# EAGLE design Mimi_layout_logo (EAGLE 7.6.0)
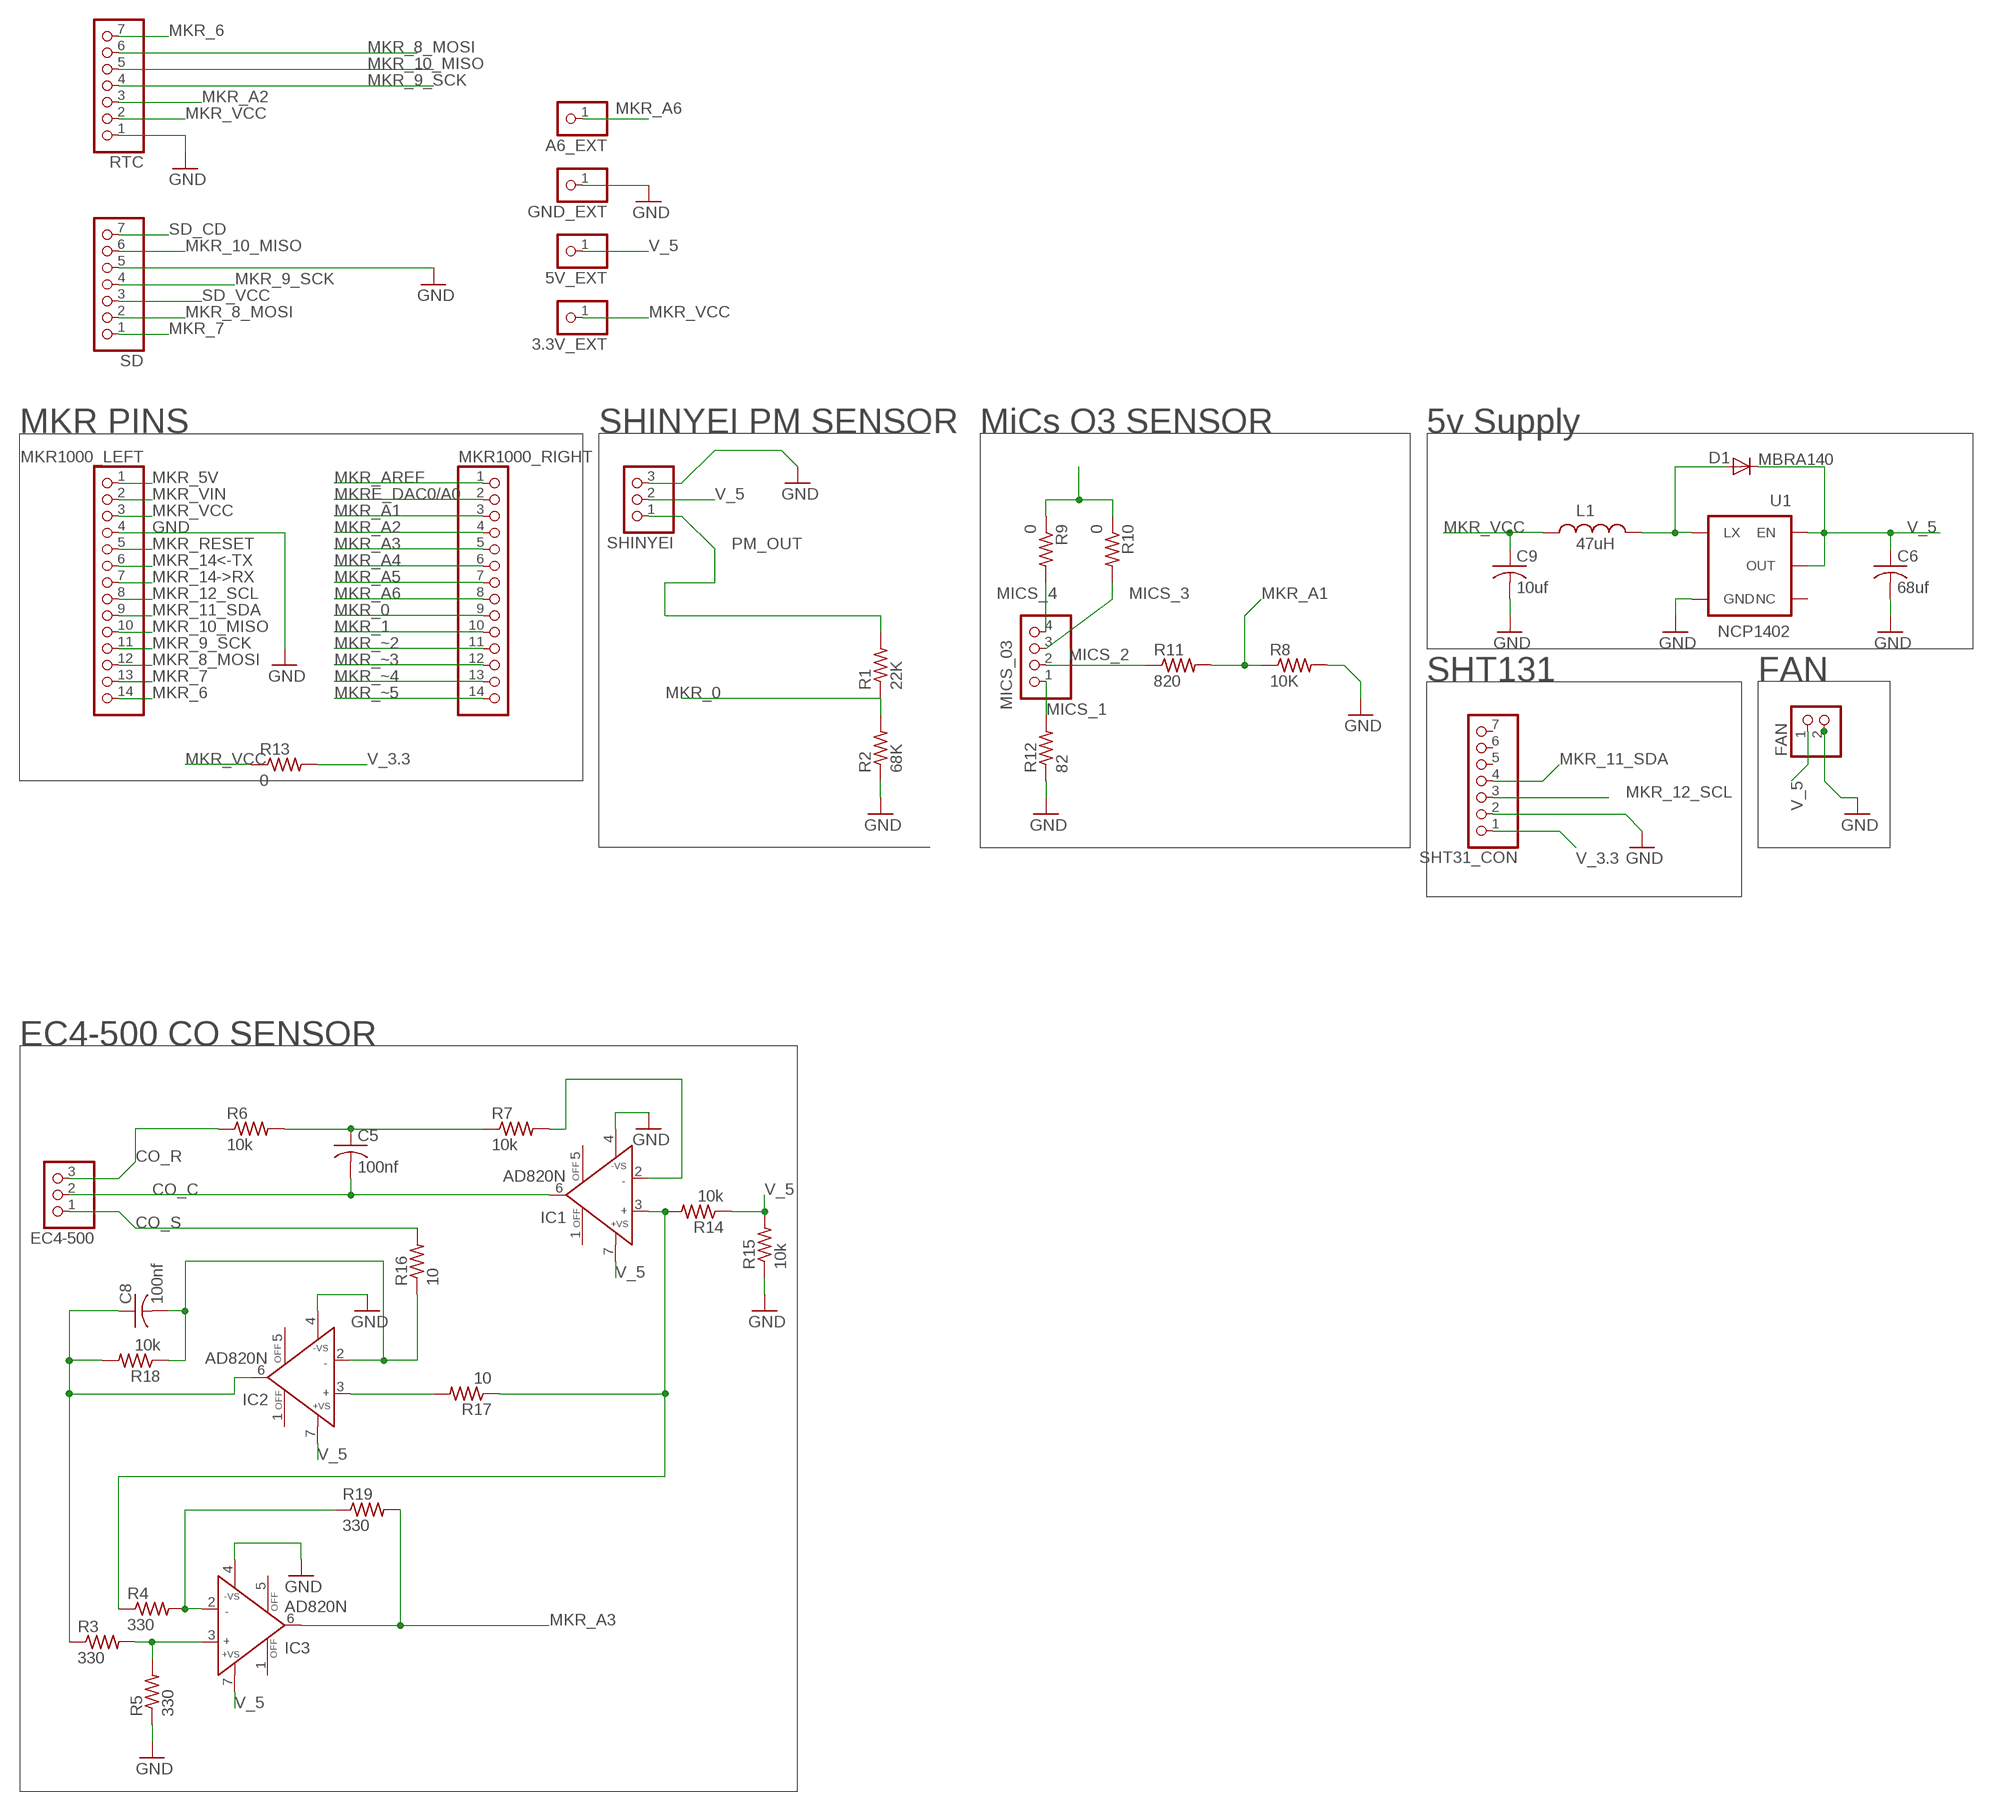
[diagram p0: schematic, sheet 1]

## Parts
3.3V_EXT  PINHD-1X1  [1X01]
5V_EXT  PINHD-1X1  [1X01]
A6_EXT  PINHD-1X1  [1X01]
C5  100nf  C-USC0805  [C0805]
C6  68uf  C-USC0805  [C0805]
C8  100nf  C-USC0805  [C0805]
C9  10uf  C-USC0805  [C0805]
D1  MBRA140  DIODESMA  [SMA-DIODE]
EC4-500  PINHD-1X3  [1X03]
FAN  PINHD-1X2  [1X02]
GND_EXT  PINHD-1X1  [1X01]
IC1  AD820N  [DIL08]
IC2  AD820N  [DIL08]
IC3  AD820N  [DIL08]
L1  47uH  INDUCTORCR54  [CR54]
MICS_03  PINHD-1X4  [1X04]
MKR1000_LEFT  PINHD-1X14  [1X14]
MKR1000_RIGHT  PINHD-1X14  [1X14]
R1  22K  R-US_R0805  [R0805]
R2  68K  R-US_R0805  [R0805]
R3  330  R-US_R0805  [R0805]
R4  330  R-US_R0805  [R0805]
R5  330  R-US_R0805  [R0805]
R6  10k  R-US_R0805  [R0805]
R7  10k  R-US_R0805  [R0805]
R8  10K  R-US_R0805  [R0805]
R9  0  R-US_R0805  [R0805]
R10  0  R-US_R0805  [R0805]
R11  820  R-US_R0805  [R0805]
R12  82  R-US_R0805  [R0805]
R13  0  R-US_R0805  [R0805]
R14  10k  R-US_R0805  [R0805]
R15  10k  R-US_R0805  [R0805]
R16  10  R-US_R0805  [R0805]
R17  10  R-US_R0805  [R0805]
R18  10k  R-US_R0805  [R0805]
R19  330  R-US_R0805  [R0805]
RTC  PINHD-1X7  [1X07]
SD  PINHD-1X7  [1X07]
SHINYEI  PINHD-1X3  [1X03]
SHT31_CON  PINHD-1X7  [1X07]
U1  NCP1402  V_REG_NCP1400SOT23-5  [SOT23-5]

## Nets
CO_C: C5.2 EC4-500.2 IC1.6(OUT)
CO_R: EC4-500.3 R6.1
CO_S: EC4-500.1 R16.2
GND: C6.2 C9.2 FAN.2 GND_EXT.1 IC1.4(-VS) IC2.4(-VS) IC3.4(-VS) MKR1000_LEFT.4 R2.1 R5.1 R8.2 R12.1 R15.1 RTC.1 SD.5 SHINYEI.3 SHT31_CON.2 U1.4(GND)
MICS_1: MICS_03.1 R12.2
MICS_2: MICS_03.2 R11.1
MICS_3: MICS_03.3 R10.2
MICS_4: MICS_03.4 R9.2
MKR_0: MKR1000_RIGHT.9 R1.1 R2.2
MKR_1: MKR1000_RIGHT.10
MKR_5V: MKR1000_LEFT.1
MKR_6: MKR1000_LEFT.14 RTC.7
MKR_7: MKR1000_LEFT.13 SD.1
MKR_8_MOSI: MKR1000_LEFT.12 RTC.6 SD.2
MKR_9_SCK: MKR1000_LEFT.11 RTC.4 SD.4
MKR_10_MISO: MKR1000_LEFT.10 RTC.5 SD.6
MKR_11_SDA: MKR1000_LEFT.9 SHT31_CON.4
MKR_12_SCL: MKR1000_LEFT.8 SHT31_CON.3
MKR_14->RX: MKR1000_LEFT.7
MKR_14<-TX: MKR1000_LEFT.6
MKR_A1: MKR1000_RIGHT.3 R8.1 R11.2
MKR_A2: MKR1000_RIGHT.4 RTC.3
MKR_A3: IC3.6(OUT) MKR1000_RIGHT.5 R19.2
MKR_A4: MKR1000_RIGHT.6
MKR_A5: MKR1000_RIGHT.7
MKR_A6: A6_EXT.1 MKR1000_RIGHT.8
MKR_AREF: MKR1000_RIGHT.1
MKR_RESET: MKR1000_LEFT.5
MKR_VCC: 3.3V_EXT.1 C9.1 L1.P$1 MKR1000_LEFT.3 R13.1 RTC.2
MKR_VIN: MKR1000_LEFT.2
MKR_~2: MKR1000_RIGHT.11
MKR_~3: MKR1000_RIGHT.12
MKR_~4: MKR1000_RIGHT.13
MKR_~5: MKR1000_RIGHT.14
MKRE_DAC0/A0: MKR1000_RIGHT.2
N$3: D1.A L1.P$2 U1.5(LX)
N$4: C5.1 R6.2 R7.1
N$5: IC1.3(IN+) R4.1 R14.2 R17.1
N$6: IC1.2(IN-) R7.2
N$7: IC2.3(IN+) R17.2
N$8: C8.2 IC2.2(IN-) R16.1 R18.1
N$9: C8.1 IC2.6(OUT) R3.1 R18.2
N$10: IC3.3(IN+) R3.2 R5.2
N$11: IC3.2(IN-) R4.2 R19.1
PM_OUT: R1.2 SHINYEI.1
SD_CD: SD.7
SD_VCC: SD.3
V_3.3: R13.2 SHT31_CON.1
V_5: 5V_EXT.1 C6.1 D1.C FAN.1 IC1.7(+VS) IC2.7(+VS) IC3.7(+VS) R9.1 R10.1 R14.1 R15.2 SHINYEI.2 U1.1(EN) U1.2(OUT)
Unconnected: IC1.1(OFF) IC1.5(OFF) IC2.1(OFF) IC2.5(OFF) IC3.1(OFF) IC3.5(OFF) SHT31_CON.5 SHT31_CON.6 SHT31_CON.7 U1.3(NC)

## Notes on the sheet
- MKR PINS | SHINYEI PM SENSOR | MiCs O3 SENSOR | 5v Supply
- SHT131 | FAN
- EC4-500 CO SENSOR

## Library data of the parts
3.3V_EXT 5V_EXT A6_EXT GND_EXT = pinhead:PINHD-1X1: PIN HEADER
C5 C6 C8 C9 = resistor:C-US: CAPACITOR, American symbol
D1 = SparkFun:DIODE: Diode These are standard reverse protection diodes and small signal diodes. SMA package can handle up to about 1A. SOD-323 can handle about 200mA. What the SOD-323 package when ordering, there are some mfgs out there that are 5-pin packages.
EC4-500 SHINYEI = pinhead:PINHD-1X3: PIN HEADER
FAN = pinhead:PINHD-1X2: PIN HEADER
IC1-IC3 = analog-devices:AD820N: Single-Supply, Rail-to-Rail, Low Power, FET Input Op Amp Source: http://www.analog.com/static/imported-files/data_sheets/AD820.pdf; OC_FARNELL: 1438579; OC_NEWARK: unknown
L1 = SparkFun:INDUCTOR: Inductors Basic Inductor/Choke - 0603 and 1206. Footprints are not proven and vary greatly between part numbers.
MICS_03 = pinhead:PINHD-1X4: PIN HEADER
MKR1000_LEFT MKR1000_RIGHT = pinhead:PINHD-1X14: PIN HEADER
R1-R19 = resistor:R-US_: RESISTOR, American symbol
RTC SD SHT31_CON = pinhead:PINHD-1X7: PIN HEADER
U1 = SparkFun:V_REG_NCP1400: Switching step-up voltage regulator NCP1400 switiching regulator takes single cell AA and outputs 100mA at 3.3V or 5V with minimal number of external components.

## Board
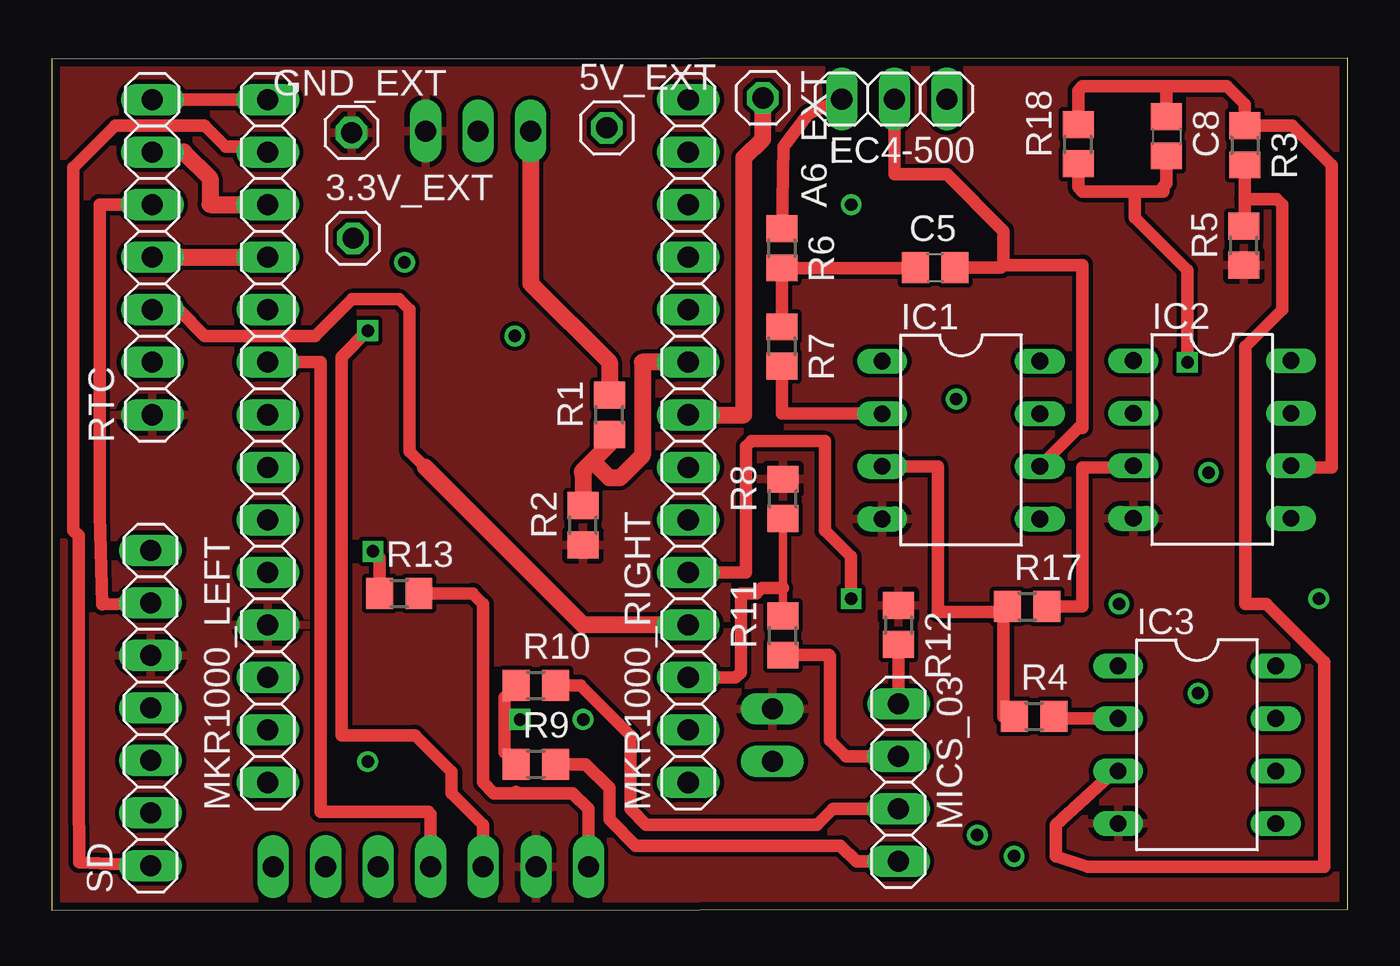
[diagram p1: board, top side]
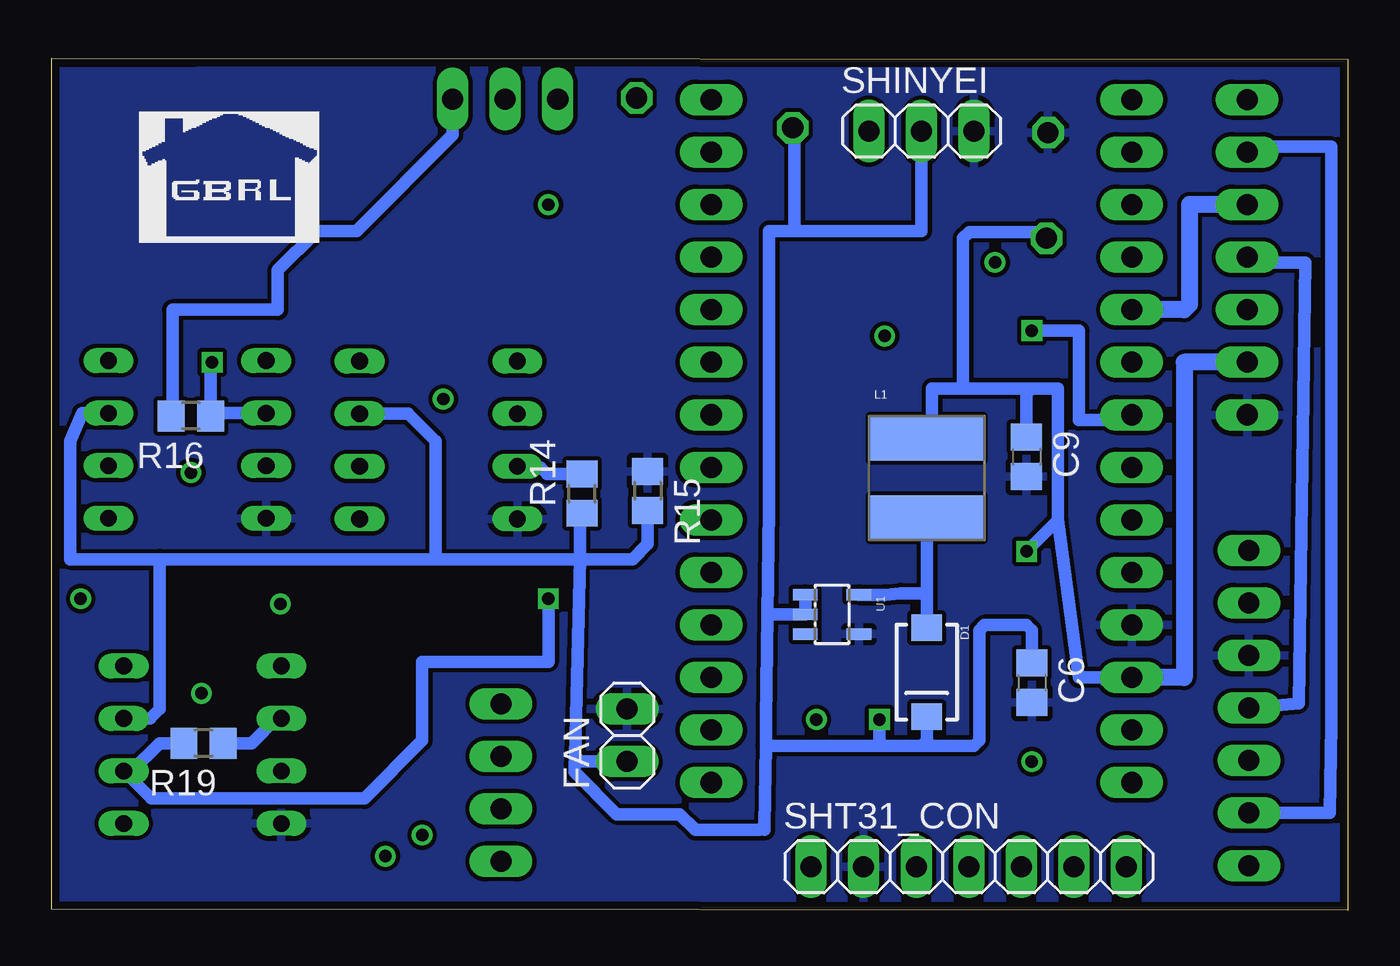
[diagram p2: board, bottom side, seen from below]

Size 62.64 x 41.18 mm. Coordinates in mm from the lower left corner, seen from the top.
Outline: 0,0 62.64,0.04 62.64,41.18 0,41.14 0,0
Copper layers (1*16): Top 0.0178mm / dielectric 59mil / Bottom 0.0178mm
Design rules "epl-lpkf": minimum track width 8mil, minimum drill 0.35mm, track to track 8mil, track to pad 8mil, pad to pad 8mil, via to via 8mil, smd to smd 8mil, copper to edge 15mil, drill to drill 15mil, minimum pad ring 8mil, minimum via ring 8mil, stop-mask expansion 3mil, vias tented up to drill 0mil, thermal gap 10mil

### Footprints (pad centres in the part's own frame; a part is rotated, then mirrored left to right if it is on the bottom)
1X01 = drill 1.016 octagon: 1 0,0
C0805 = smd 1.3 x 1.5: 1 -0.95,0; 2 0.95,0
SMA-DIODE = smd 1.27 x 1.47: A -2.15,0; C 2.15,0
1X03 = drill 1.016 long: 1 -2.54,0; 2 0,0; 3 2.54,0
1X02 = drill 1.016 long: 1 -1.27,0; 2 1.27,0
DIL08 = drill 0.813 long: 1 -3.81,-3.81; 2 -1.27,-3.81; 3 1.27,-3.81; 4 3.81,-3.81; 5 3.81,3.81; 6 1.27,3.81; 7 -1.27,3.81; 8 -3.81,3.81
CR54 = smd 5.5 x 2.15: P$1 0,1.92; P$2 0,-1.92
1X04 = drill 1.016 long: 1 -3.81,0; 2 -1.27,0; 3 1.27,0; 4 3.81,0
1X14 = drill 1.016 long: 1 -16.51,0; 2 -13.97,0; 3 -11.43,0; 4 -8.89,0; 5 -6.35,0; 6 -3.81,0; 7 -1.27,0; 8 1.27,0; 9 3.81,0; 10 6.35,0; 11 8.89,0; 12 11.43,0; 13 13.97,0; 14 16.51,0
R0805 = smd 1.3 x 1.5: 1 -0.95,0; 2 0.95,0
1X07 = drill 1.016 long: 1 -7.62,0; 2 -5.08,0; 3 -2.54,0; 4 0,0; 5 2.54,0; 6 5.08,0; 7 7.62,0
SOT23-5 = smd 0.55 x 1.2: 1 -0.95,-1.3; 2 0,-1.3; 3 0.95,-1.3; 4 0.95,1.3; 5 -0.95,1.3

### Placement (x,y rotation side)
3.3V_EXT  14.56,32.48 0 top
5V_EXT  26.83,37.81 0 top
A6_EXT  34.37,39.26 270 top
C5  42.7,31.05 0 top
C6  15.27,10.99 270 bottom
C8  53.88,37.4 270 top
C9  15.53,21.91 270 bottom
D1  20.35,11.5 270 bottom
EC4-500  40.72,39.21 180 top
FAN  34.83,8.45 90 bottom
GND_EXT  14.48,37.58 0 top
IC1  43.95,22.72 270 top
IC2  56.09,22.75 270 top
IC3  55.35,7.99 270 top
L1  20.35,20.89 0 bottom
MICS_03  40.93,6.16 270 top
MKR1000_LEFT  10.45,22.67 90 top
MKR1000_RIGHT  30.77,22.67 90 top
R1  26.96,23.94 90 top
R2  25.69,18.61 90 top
R3  57.66,36.97 270 top
R4  47.48,9.36 0 top
R5  57.61,32.12 90 top
R6  35.29,31.99 270 top
R7  35.29,27.24 270 top
R8  35.34,19.88 90 top
R9  23.4,7.05 0 top
R10  23.4,10.86 0 top
R11  35.34,13.27 90 top
R12  40.93,13.78 270 top
R13  16.8,15.31 0 top
R14  37.01,20.13 90 bottom
R15  33.84,20.26 270 bottom
R16  55.91,23.89 180 bottom
R17  47.15,14.67 0 top
R18  49.61,37.02 90 top
R19  55.3,8.07 180 bottom
RTC  4.86,31.56 90 top
SD  4.78,9.77 90 top
SHINYEI  20.61,37.66 0 bottom
SHT31_CON  18.32,2.1 0 bottom
U1  24.92,14.29 270 bottom

### Tracks (layer width: path | path; a pad name or v marks a point on that pad's centre or on a via)
CO_C
  Top 0.61: 46.01,31.18 49.82,31.18 49.82,23.31 49.61,23.31 IC1.6 | EC4-500.2 40.72,35.57 43.26,35.57 46.01,32.83 46.01,31.18 | C5.2 45.88,31.05 46.01,31.18
CO_R
  Top 0.61: R6.1 35.36,36.89 36.58,38.5 38.16,39.18 EC4-500.3
CO_S
  Bottom 0.61: EC4-500.1 43.26,37.48 47.91,32.83 49.82,32.83 51.72,30.93 51.72,29.02 56.8,29.02 56.8,23.95 R16.2
GND
  pour Bottom: 0.21,40.76 62.59,40.55 62.59,0.17 0.21,0.37
  pour Top: 0.06,40.74 62.59,40.65 62.85,0.27 0.31,0.35
MICS_1
  Top 0.61: R12.2 MICS_03.1
MICS_2
  Top 0.61: 40.93,7.75 MICS_03.2 38.39,7.43 37.62,8.19 37.62,12.26 37.56,12.32 R11.1
MICS_3
  Top 0.61: MICS_03.3 37.75,4.89 36.99,4.13 28.73,4.13 27.97,4.89 27.97,8.45 25.56,10.86 R10.2
MICS_4
  Top 0.61: MICS_03.4 38.89,2.35 38.13,3.11 28.23,3.11 26.96,4.38 26.96,5.91 25.81,7.05 R9.2
MKR_0
  Top 0.813: MKR1000_RIGHT.9 28.55,26.48 28.55,21.97 27.46,20.89 26.96,20.89 26.14,21.71 | R2.2 25.69,20.99 25.64,21.2 26.14,21.71 | R1.1 26.96,22.52 26.14,21.71
MKR_6
  Top 0.61: RTC.7 MKR1000_LEFT.14
MKR_7
  Top 0.61: SD.1 1.33,2.3 1.3,5.91 1.3,18.1 1.05,18.35 1.05,35.88 3.08,37.91 7.4,37.91 8.41,36.89 10.19,36.89 MKR1000_LEFT.13
MKR_8_MOSI
  Top 0.813: RTC.6 6.38,36.64 7.65,35.37 7.65,34.1 MKR1000_LEFT.12
  Bottom 0.61: SD.2 0.87,4.69 0.79,8.95 0.79,36.89 4.6,36.89 RTC.6
MKR_9_SCK
  Top 0.813: RTC.4 MKR1000_LEFT.11
  Bottom 0.61: SD.4 2.37,10 2.06,31.31 4.6,31.31 RTC.4
MKR_10_MISO
  Top 0.61: SD.6 2.44,14.77 2.32,19.11 2.32,34.1 RTC.5
  Bottom 0.813: RTC.5 7.65,34.1 7.65,29.27 7.91,29.02 MKR1000_LEFT.10
MKR_11_SDA
  Top 0.61: MKR1000_LEFT.9 12.99,26.48 12.99,4.74 18.22,4.74 18.32,4.64 SHT31_CON.4
MKR_12_SCL  (via drill 0.6)
  Top 0.61: v15.27,28 14,26.73 14,8.45 17.56,8.45 19.34,6.67 19.34,5.65 20.86,4.13 SHT31_CON.3
  Bottom 0.61: MKR1000_LEFT.8 10.7,23.69 12.99,23.69 12.99,28 v15.27,28
MKR_A1
  Top 0.406: R11.2 35.34,15.56 R8.1
  Top 0.61: MKR1000_RIGHT.3 33.05,11.24 33.31,11.49 33.31,15.3 34.07,15.3 34.32,15.56 35.34,15.56
MKR_A2
  Top 0.61: 18.07,21.4 17.3,22.16 17.3,29.02 16.8,29.53 14.51,29.53 12.73,27.75 7.4,27.75 6.13,29.02 RTC.3
  Top 0.813: MKR1000_RIGHT.4 25.69,13.78 18.07,21.4
MKR_A3  (via drill 0.6)
  Top 0.61: v38.64,15.05 38.64,17.08 37.37,18.35 37.37,22.67 33.81,22.67 33.56,22.42 33.56,16.32 MKR1000_RIGHT.5
  Bottom 0.61: R19.2 57.44,8.07 58.78,6.72 IC3.6 57.84,5.4 47.53,5.4 44.74,8.19 44.74,12 38.64,12 v38.64,15.05
MKR_A6
  Top 0.813: MKR1000_RIGHT.8 33.46,23.94 33.46,36.36 34.37,37.28 A6_EXT.1
MKR_VCC  (via drill 0.6)
  Top 0.61: R13.1 15.85,17.02 v15.53,17.34
  Bottom 0.61: 15.27,25.21 14,25.21 14,18.86 | 15.27,25.21 18.6,25.21 | 18.6,25.21 20.1,25.21 20.1,23.07 L1.P$1 | 11.72,11.24 12.99,11.24 14,18.86 | v15.53,17.34 14,18.86 | C9.1 15.53,24.96 15.27,25.21 | 3.3V_EXT.1 14.87,32.78 18.29,32.78 18.6,32.48 18.6,25.21
  Bottom 0.813: 11.72,11.24 MKR1000_LEFT.3 7.91,11.24 7.91,26.48 RTC.2
N$1  (via drill 0.6)
  other vias: 38.64,34.1
N$2  (via drill 0.6)
  other vias: 17.05,31.31
N$3
  Bottom 0.61: L1.P$2 20.35,15.3 | 20.35,15.3 D1.A | U1.5 22.38,15.24 21.62,15.3 20.35,15.3
N$4
  Top 0.61: R7.1 R6.2 C5.1
N$5
  Top 0.61: IC1.3 42.83,21.45 42.83,14.42 46.01,14.42 | R17.1 46.2,14.42 46.01,14.42 | 46.01,14.42 46.01,9.34 46.53,9.34 R4.1
  Bottom 0.61: R14.2 38.7,21.08 39.02,21.4 40.09,21.4 IC1.3
N$6
  Top 0.61: IC1.2 35.29,23.99 R7.2
N$7
  Top 0.61: R17.2 49.82,14.67 49.82,21.4 52.28,21.4 IC2.3
N$8  (via drill 0.6)
  Top 0.61: R18.1 49.61,34.94 49.82,34.74 52.36,34.74 | 52.36,34.74 53.73,34.74 53.73,34.97 53.88,35.12 C8.2 | v54.9,26.48 54.9,30.93 52.36,33.47 52.36,34.74
  Bottom 0.61: IC2.2 54.96,24.02 | 54.96,24.02 R16.1 | 54.96,24.02 54.96,26.41 v54.9,26.48
N$9
  Top 0.61: R18.2 49.61,39.61 49.82,39.82 53.88,39.82 | 53.88,39.82 56.8,39.82 57.66,38.95 R3.1 59.97,37.92 61.88,36.01 61.88,21.4 59.98,21.4 IC2.6 | C8.1 53.88,39.82
N$10
  Top 0.61: R3.2 57.66,34.35 | 57.66,34.35 57.66,33.12 R5.2 | IC3.3 51.39,6.72 48.55,4.13 48.55,2.6 50.07,2.1 61.5,2.1 61.5,12 58.71,14.8 57.69,14.8 57.69,27.24 59.47,29.02 59.47,34.1 59.21,34.35 57.66,34.35
N$11
  Top 0.61: IC3.2 48.53,9.26 R4.2
  Bottom 0.61: IC3.2 51.8,9.26 52.99,8.07 R19.1
N$12  (via drill 0.6)
  other vias: 25.69,9.21
N$13  (via drill 0.6)
  other vias: 44.74,3.62
N$14  (via drill 0.6)
  other vias: 51.59,14.8
N$15  (via drill 0.6)
  other vias: 61.25,15.05
N$16  (via drill 0.6)
  other vias: 22.38,27.75
N$17  (via drill 0.6)
  other vias: 15.27,7.18
N$18  (via drill 0.6)
  other vias: 46.51,2.61
N$19  (via drill 0.6)
  other vias: 55.4,10.48
N$20  (via drill 0.6)
  other vias: 55.91,21.15
N$21  (via drill 0.6)
  other vias: 43.72,24.7
PM_OUT
  Top 0.813: SHINYEI.1 23.15,30.29 26.96,26.48 R1.2
V_3.3
  Top 0.61: 22.45,5.72 22.38,5.65 | 22.38,5.65 25.18,5.65 25.94,4.89 SHT31_CON.1 | R13.2 20.35,15.3 20.86,14.8 20.86,6.16 21.37,5.65 22.38,5.65
V_5  (via drill 0.6)
  Top 0.406: R10.1 21.88,10.29 | R9.1 21.88,7.62
  Top 0.61: 21.88,10.29 21.88,9.21 | 21.88,9.21 v22.64,9.21 | 21.88,7.62 21.88,9.21
  Bottom 0.61: 28.04,14.3 27.97,19.37 27.97,32.83 26.75,32.83 | 28.04,14.3 28.11,9.21 | 28.11,9.21 28.13,7.94 | 28.13,7.94 28.18,4.12 | 28.18,4.12 28.19,3.88 28.19,3.87 | 37.36,7.44 37.37,6.92 37.37,6.67 35.34,4.64 32.29,4.64 31.53,3.87 28.43,3.87 28.18,4.12 | 37.36,7.44 37.12,16.96 | 37.12,16.96 37.12,19.08 R14.1 | R15.2 33.84,17.69 34.58,16.96 37.12,16.96 | IC1.7 45.42,23.99 44.1,22.67 44.1,16.96 | 44.1,16.96 37.12,16.96 | IC2.7 61.17,24.02 61.75,22.67 61.75,16.96 57.44,16.96 | 57.44,16.96 44.1,16.96 | IC3.7 57.89,9.26 57.44,9.72 57.44,16.96 | SHINYEI.2 20.61,32.83 26.75,32.83 | U1.1 U1.2 28.03,14.29 28.04,14.3 | 28.11,9.46 28.11,9.21 | FAN.1 37.09,7.18 37.36,7.44 | 20.61,7.94 18.07,7.94 17.81,8.19 17.81,13.53 17.56,13.78 15.53,13.78 15.27,13.53 C6.1 | 20.61,7.94 22.64,7.94 | 22.64,7.94 28.12,7.94 28.13,7.94 | D1.C 20.35,8.19 20.61,7.94 | v22.64,9.21 22.64,7.94 | 5V_EXT.1 26.75,37.73 26.75,32.83